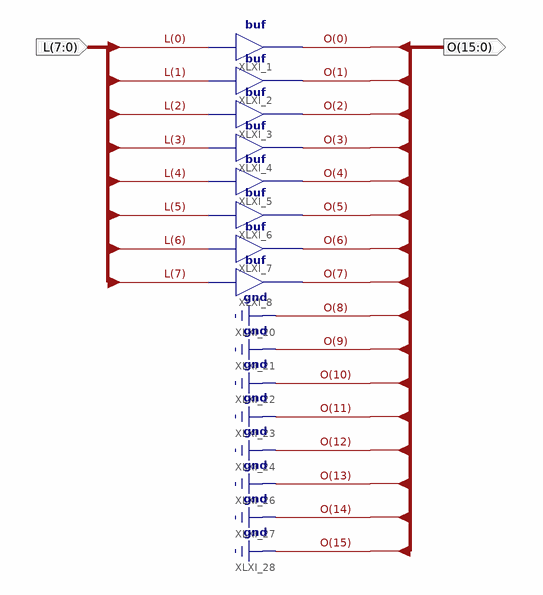
[diagram p0: schematic sheet 1]
// Xilinx ISE schematic resize8x16x0l.sch (spartan6) as structural Verilog: 8 symbols, 2 ports
module resize8x16x0l (
  input  [7:0] L,
  output [15:0] O
);

  buf XLXI_1 (O[0], L[0]);
  buf XLXI_2 (O[1], L[1]);
  buf XLXI_3 (O[2], L[2]);
  buf XLXI_4 (O[3], L[3]);
  buf XLXI_5 (O[4], L[4]);
  buf XLXI_6 (O[5], L[5]);
  buf XLXI_7 (O[6], L[6]);
  buf XLXI_8 (O[7], L[7]);

  assign O[15:8] = {8{1'b0}};
endmodule
